# Altium schematic sheet thermokoppel.SchDoc: Thermokoppel
size A4; DrawnBy: Jelle Claes; SheetNumber: 3; SheetTotal: 4
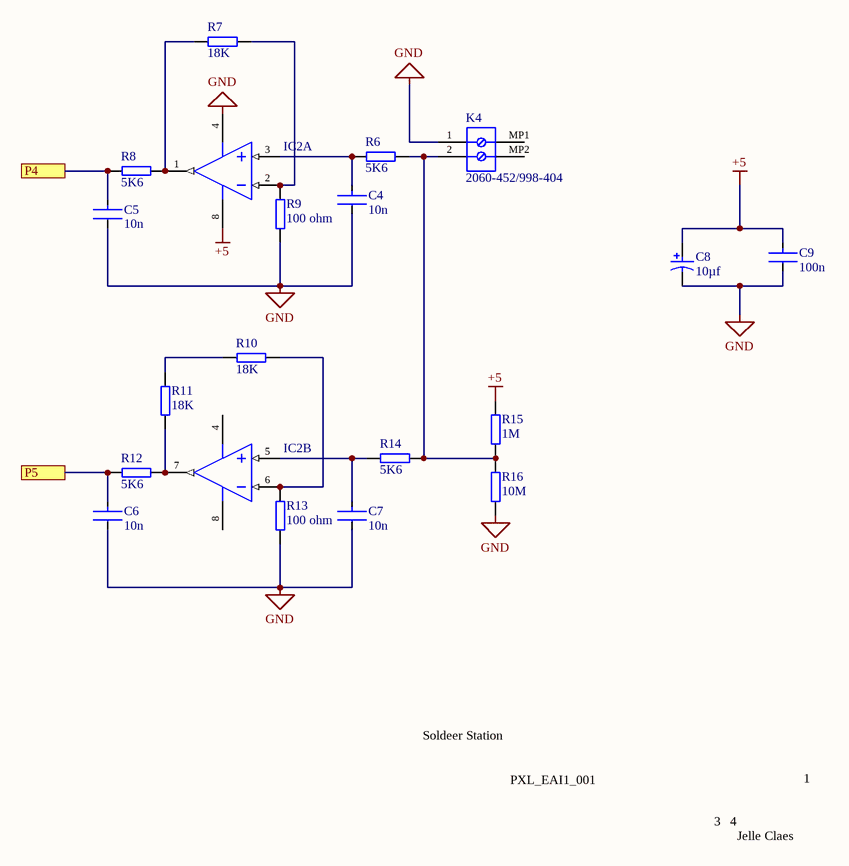
[diagram p0: thermokoppel.SchDoc]

## Parts
C4  10n  [CC_0805_m]
C5  10n  [CC_0805_m]
C6  10n  [CC_0805_m]
C7  10n  [CC_0805_m]
C8  10µf  [CE_D8_L10]
C9  100n  [CC_0805_m]
IC2  Dual_Opamp  [MSOP_8_M]  (value not drawn)  (parts A,B of 2)
K4  2060-452/998-404  [WAGO-2060-452_V]
R6  5K6  [R_0805_M]
R7  18K  [R_0805_M]
R8  5K6  [R_0805_M]
R9  100 ohm  [R_0805_M]
R10  18K  [R_0805_M]
R11  18K  [R_0805_M]
R12  5K6  [R_0805_M]
R13  100 ohm  [R_0805_M]
R14  5K6  [R_0805_M]
R15  1M  [R_0805_M]
R16  10M  [R_0805_M]

## Ports
P4 (see CPU[3B]), P5 (see CPU[3B])

## Nets
+5: C8.2 C9.1 IC2.8(VDD) R15.2
GND: C4.2 C5.2 C6.2 C7.2 C8.1 C9.2 IC2.4(VSS) K4.1 R9.2 R13.2 R16.1
P4: C5.1 R8.1 ; port P4
P5: C6.1 R12.2 ; port P5
NetC4_1: C4.1 IC2.3(VINA+) R6.1
NetC7_1: C7.1 IC2.5(VINB+) R14.1
NetIC2_1: IC2.1(VOUTA) R7.1 R8.2
NetIC2_2: IC2.2(VINA-) R7.2 R9.1
NetIC2_6: IC2.6(VINB-) R10.2 R13.1
NetIC2_7: IC2.7(VOUTB) R11.1 R12.1
NetK4_2: K4.2 R6.2 R14.2 R15.1 R16.2
NetR10_1: R10.1 R11.2

Not connected (* = marked no-connect by the designer): K4 MP1 MP2

## Notes on the sheet
- Soldeer Station
- PXL_EAI1_001
- 3
- 4
- 1
- Jelle Claes

## Library data of the parts
C4-C7 C9 = Capacitor_Ceramic: Manufacturer: KEMET; Manufacturer Part Number: C0805C224K5RACTU; Value: 0.22 μF; Temperature Characteristic: X7R; Temperature Coefficient: 30ppm/°C; Tolerance: 0.1; Voltage Rating: 50 V; ComponentLink2URL: https://content.kemet.com/datasheets/KEM_C1003_C0G_SMD.pdf; Device Class L3: Ceramic Capacitors; Lead Free: Yes; Temperature: -55°C to +125°C; RoHS: TRUE; Capacitance: 0.22 μF; Automotive: No; Material: Ceramic; Octopart: https://octopart.com/c0805c224k5ractu-kemet-144670; Temperature Range Low: -55°C; Height: 0.88mm; Device Class L1: Passive Components; Digikey Description: CAP CER 0.22UF 50V X7R 0805; ComponentLink2Description: Datasheet; Mouser Description: CAP CER 0.22UF 50V X7R 0805; Category: Cap; Ipc Land Pattern Name: CAPC200125X78; Temperature Range High: +125°C; Package: C0805C-DN; Device Class L2: Capacitors
C8 = Capacitor_Electrolytic: Manufacturer: Panasonic; Voltage Rating: 25 V; ComponentLink2URL: http://industrial.panasonic.com/cdbs/www-data/pdf/RDE0000/ABA0000C1181.pdf; Height: 10.2 mm; Max Operating Temperature: 105 degC; PackageReference: EEE-FK1E221P; ComponentLink1Description: Manufacturer URL; ComponentLink1URL: http://www.panasonic.com/; Mount: Surface Mount; REACH SVHC: No SVHC; Min Operating Temperature: -55 degC; ComponentLink2Description: Datasheet; DatasheetVersion: 03/2016; Length: 10.2 mm; RoHSCompliant: true; Packaging: Tape and Reel; Package Quantity: 500; Lead Pitch: 3.1 mm; Pins: 2; PackageDescription: 2-Pin Electrolytic Aluminum Capacitor, Body 8.3 x 8.3 mm; Mounting Technology: Surface Mount
IC2 = Dual_Opamp: Slew Rate: 0.6V/µs; Supply Current: 100uA; Power Supply Rejection Ratio (PSRR): 86dB; Input Offset Voltage (Vos): 4.5mV; Input Bias Current: 1pA; Amplifier Type: GENERAL PURPOSE; Unity Gain Bandwidth Product: 1MHz; Number of Circuits: 2; Output Current: 23mA; Operating Supply Voltage: 5.5V; Min Supply Voltage: 1.8V; Common Mode Rejection Ratio: 60dB; Voltage Gain: 112dB; Max Supply Voltage: 6V; Package Quantity: 60; REACH SVHC: No SVHC; Min Operating Temperature: -40°C; Max Operating Temperature: 125°C; Mount: Through Hole; Nominal Supply Current: 100uA; Height: 3.3mm; Length: 9.27mm; Slew Rate-Nom: 0.6V/µs; Packaging: Rail/Tube; Output Current per Channel: 23mA; Number of Amplifiers: 2; RoHS Compliant: Yes; Radiation Hardening: No; Bandwidth: 1MHz; Lead Free: Lead Free; Width: 6.35mm; Number of Channels: 2; Gain Bandwidth Product: 1MHz; Technology: CMOS; Operating Supply Current: 100uA; Number of Elements: 2; Number of Pins: 8; Input Offset Voltage-Max: 4.5mV; Case/Package: PDIP
K4 = WAGO-2060: Terminal Block, Pitch 4 mm, 1 x 2 Position, Height 4.5 mm, -60 to 105 degC, RoHS, Tape and Reel; Manufacturer: WAGO; Number of contacts: 2; Content: 1pc(s); Min. cross section (flexible): 0.25mm²; Stripping length: 6-7mm; Nominal current: 9A; Nominal voltage: 160V; Pitch: 4mm; Min. cross section (unflexible): 0.2mm²; Max. cross section (inflexible): 0.75mm²; AWG: 24-18; Connection: Pullspring; Type: 2060-452/998-404; Package Reference: 2060-452; Mounting Technology: SurfaceMount; Colour: White; Package Description: Terminal Block, Pitch 4 mm, 1 x 2 Position, Height 4.5 mm; Height: 4.5mm; Manufacturer URL: http://global.wago.com/en/index-en.jsp; Material: PPA-GFenclosure·Tin-platedcoppercontacts; Width: 10.1mm; Manufacturer part No.: 2060-452/998-404; Datasheet URL: http://www.wago.com/infomaterial/pdf/60255126.pdf; Contact material: Tinplated; Length: 7.9mm; Max. cross section (flexible): 0.75mm²; Datasheet Version: 03/2015
R6-R16 = Resistor: Manufacturer: Vishay Dale; Part Number: CRCW08050000Z0EA